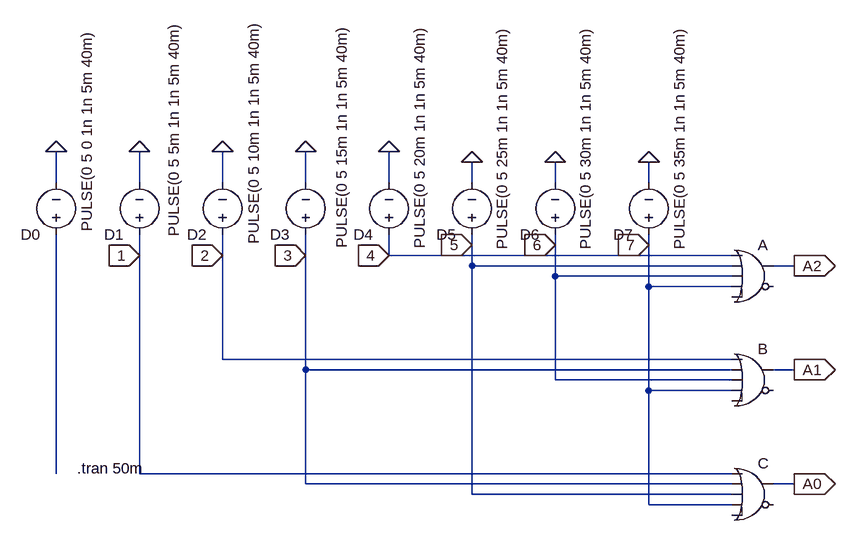
[diagram p0: schematic 8-3Encoder.asc]
8-3Encoder.asc, the LTspice schematic file:
Version 4.1
SHEET 1 1748 680
WIRE 32 64 32 16
WIRE 160 64 160 16
WIRE 288 64 288 16
WIRE 416 64 416 16
WIRE 544 64 544 16
WIRE 672 64 672 32
WIRE 800 64 800 32
WIRE 944 64 944 32
WIRE 672 160 672 144
WIRE 800 160 800 144
WIRE 944 160 944 144
WIRE 160 176 160 144
WIRE 288 176 288 144
WIRE 416 176 416 144
WIRE 544 176 544 144
WIRE 1072 176 544 176
WIRE 672 192 672 160
WIRE 1072 192 672 192
WIRE 1168 192 1136 192
WIRE 800 208 800 160
WIRE 1072 208 800 208
WIRE 944 224 944 160
WIRE 1072 224 944 224
WIRE 288 336 288 176
WIRE 1072 336 288 336
WIRE 416 352 416 176
WIRE 1072 352 416 352
WIRE 1168 352 1136 352
WIRE 800 368 800 208
WIRE 1072 368 800 368
WIRE 944 384 944 224
WIRE 1072 384 944 384
WIRE 32 512 32 144
WIRE 160 512 160 176
WIRE 1072 512 160 512
WIRE 416 528 416 352
WIRE 1072 528 416 528
WIRE 1168 528 1136 528
WIRE 672 544 672 192
WIRE 1072 544 672 544
WIRE 944 560 944 384
WIRE 1072 560 944 560
FLAG 32 16 0
FLAG 160 16 0
FLAG 288 16 0
FLAG 416 16 0
FLAG 544 16 0
FLAG 672 32 0
FLAG 800 32 0
FLAG 1168 192 A2
IOPIN 1168 192 Out
FLAG 1168 352 A1
IOPIN 1168 352 Out
FLAG 1168 528 A0
IOPIN 1168 528 Out
FLAG 944 32 0
FLAG 160 176 1
IOPIN 160 176 In
FLAG 288 176 2
IOPIN 288 176 In
FLAG 416 176 3
IOPIN 416 176 In
FLAG 544 176 4
IOPIN 544 176 In
FLAG 672 160 5
IOPIN 672 160 In
FLAG 800 160 6
IOPIN 800 160 In
FLAG 944 160 7
IOPIN 944 160 In
SYMBOL voltage 32 160 R180
WINDOW 3 -47 20 VRight 2
WINDOW 123 0 0 Left 0
WINDOW 39 0 0 Left 0
SYMATTR Value PULSE(0 5 0 1n 1n 5m 40m)
SYMATTR InstName D0
SYMBOL voltage 160 160 R180
WINDOW 3 -53 12 VRight 2
WINDOW 123 0 0 Left 0
WINDOW 39 0 0 Left 0
SYMATTR Value PULSE(0 5 5m 1n 1n 5m 40m)
SYMATTR InstName D1
SYMBOL voltage 288 160 R180
WINDOW 3 -48 1 VRight 2
WINDOW 123 0 0 Left 0
WINDOW 39 0 0 Left 0
SYMATTR Value PULSE(0 5 10m 1n 1n 5m 40m)
SYMATTR InstName D2
SYMBOL voltage 416 160 R180
WINDOW 3 -55 -5 VRight 2
WINDOW 123 0 0 Left 0
WINDOW 39 0 0 Left 0
SYMATTR Value PULSE(0 5 15m 1n 1n 5m 40m)
SYMATTR InstName D3
SYMBOL voltage 544 160 R180
WINDOW 3 -47 -6 VRight 2
WINDOW 123 0 0 Left 0
WINDOW 39 0 0 Left 0
SYMATTR Value PULSE(0 5 20m 1n 1n 5m 40m)
SYMATTR InstName D4
SYMBOL voltage 672 160 R180
WINDOW 3 -46 -7 VRight 2
WINDOW 123 0 0 Left 0
WINDOW 39 0 0 Left 0
SYMATTR Value PULSE(0 5 25m 1n 1n 5m 40m)
SYMATTR InstName D5
SYMBOL voltage 800 160 R180
WINDOW 3 -47 -7 VRight 2
WINDOW 123 0 0 Left 0
WINDOW 39 0 0 Left 0
SYMATTR Value PULSE(0 5 30m 1n 1n 5m 40m)
SYMATTR InstName D6
SYMBOL Digital\\or 1104 304 R0
SYMATTR InstName B
SYMBOL Digital\\or 1104 480 R0
SYMATTR InstName C
SYMBOL Digital\\or 1104 144 R0
SYMATTR InstName A
SYMBOL voltage 944 160 R180
WINDOW 3 -47 -7 VRight 2
WINDOW 123 0 0 Left 0
WINDOW 39 0 0 Left 0
SYMATTR Value PULSE(0 5 35m 1n 1n 5m 40m)
SYMATTR InstName D7
TEXT 64 504 Left 2 !.tran 50m

The netlist it stands for:
* 8-3Encoder.asc
V§D0 N001 0 PULSE(0 5 0 1n 1n 5m 40m)
V§D1 1 0 PULSE(0 5 5m 1n 1n 5m 40m)
V§D2 2 0 PULSE(0 5 10m 1n 1n 5m 40m)
V§D3 3 0 PULSE(0 5 15m 1n 1n 5m 40m)
V§D4 4 0 PULSE(0 5 20m 1n 1n 5m 40m)
V§D5 5 0 PULSE(0 5 25m 1n 1n 5m 40m)
V§D6 6 0 PULSE(0 5 30m 1n 1n 5m 40m)
A§B 2 3 6 7 0 0 A1 0 OR
A§C 1 3 5 7 0 0 A0 0 OR
A 4 5 6 7 0 0 A2 0 OR
V§D7 7 0 PULSE(0 5 35m 1n 1n 5m 40m)
.tran 50m
.backanno
.end